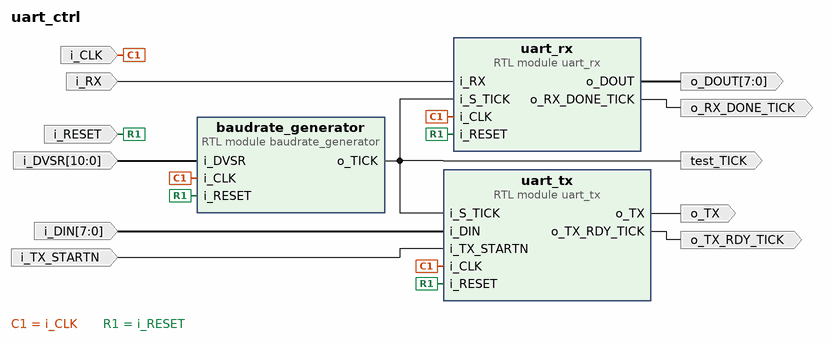
[diagram p0: block diagram of the top level]
# Vivado block design uart_ctrl, xc7z020clg400-1, Vivado 2023.2
create_bd_design uart_ctrl

create_bd_port -dir I -type rst i_RESET
set_property -dict {CONFIG.POLARITY ACTIVE_HIGH} [get_bd_ports i_RESET]
create_bd_port -dir I -type clk i_CLK
create_bd_port -dir I -from 10 -to 0 i_DVSR
create_bd_port -dir O o_RX_DONE_TICK
create_bd_port -dir O -from 7 -to 0 o_DOUT
create_bd_port -dir O o_TX_RDY_TICK
create_bd_port -dir I i_TX_STARTN
create_bd_port -dir I -from 7 -to 0 i_DIN
create_bd_port -dir I i_RX
create_bd_port -dir O o_TX
create_bd_port -dir O test_TICK

create_bd_cell -type module -reference uart_rx uart_rx
create_bd_cell -type module -reference baudrate_generator baudrate_generator
create_bd_cell -type module -reference uart_tx uart_tx

# ---- connections ----

connect_bd_net [get_bd_pins baudrate_generator/o_TICK] [get_bd_ports test_TICK] [get_bd_pins uart_rx/i_S_TICK] [get_bd_pins uart_tx/i_S_TICK]
connect_bd_net -net i_CLK_0_1 [get_bd_ports i_CLK] [get_bd_pins uart_rx/i_CLK] [get_bd_pins uart_tx/i_CLK] [get_bd_pins baudrate_generator/i_CLK]
connect_bd_net -net i_DIN_0_1 [get_bd_ports i_DIN] [get_bd_pins uart_tx/i_DIN]
connect_bd_net -net i_DVSR_0_1 [get_bd_ports i_DVSR] [get_bd_pins baudrate_generator/i_DVSR]
connect_bd_net -net i_RESET_0_1 [get_bd_ports i_RESET] \
  [get_bd_pins uart_rx/i_RESET] [get_bd_pins uart_tx/i_RESET] [get_bd_pins baudrate_generator/i_RESET]
connect_bd_net -net i_RX_0_1 [get_bd_ports i_RX] [get_bd_pins uart_rx/i_RX]
connect_bd_net -net i_TX_STARTN_0_1 [get_bd_ports i_TX_STARTN] [get_bd_pins uart_tx/i_TX_STARTN]
connect_bd_net -net uart_rx_1_o_DOUT [get_bd_pins uart_rx/o_DOUT] [get_bd_ports o_DOUT]
connect_bd_net -net uart_rx_1_o_RX_DONE_TICK [get_bd_pins uart_rx/o_RX_DONE_TICK] [get_bd_ports o_RX_DONE_TICK]
connect_bd_net -net uart_tx_0_o_TX_RDY_TICK [get_bd_pins uart_tx/o_TX_RDY_TICK] [get_bd_ports o_TX_RDY_TICK]
connect_bd_net [get_bd_pins uart_tx/o_TX] [get_bd_ports o_TX]

validate_bd_design
save_bd_design
